# Altium schematic sheet PhaseShifterB.SchDoc
size B; Organization: MASA; SheetNumber: 6; SheetTotal: 6
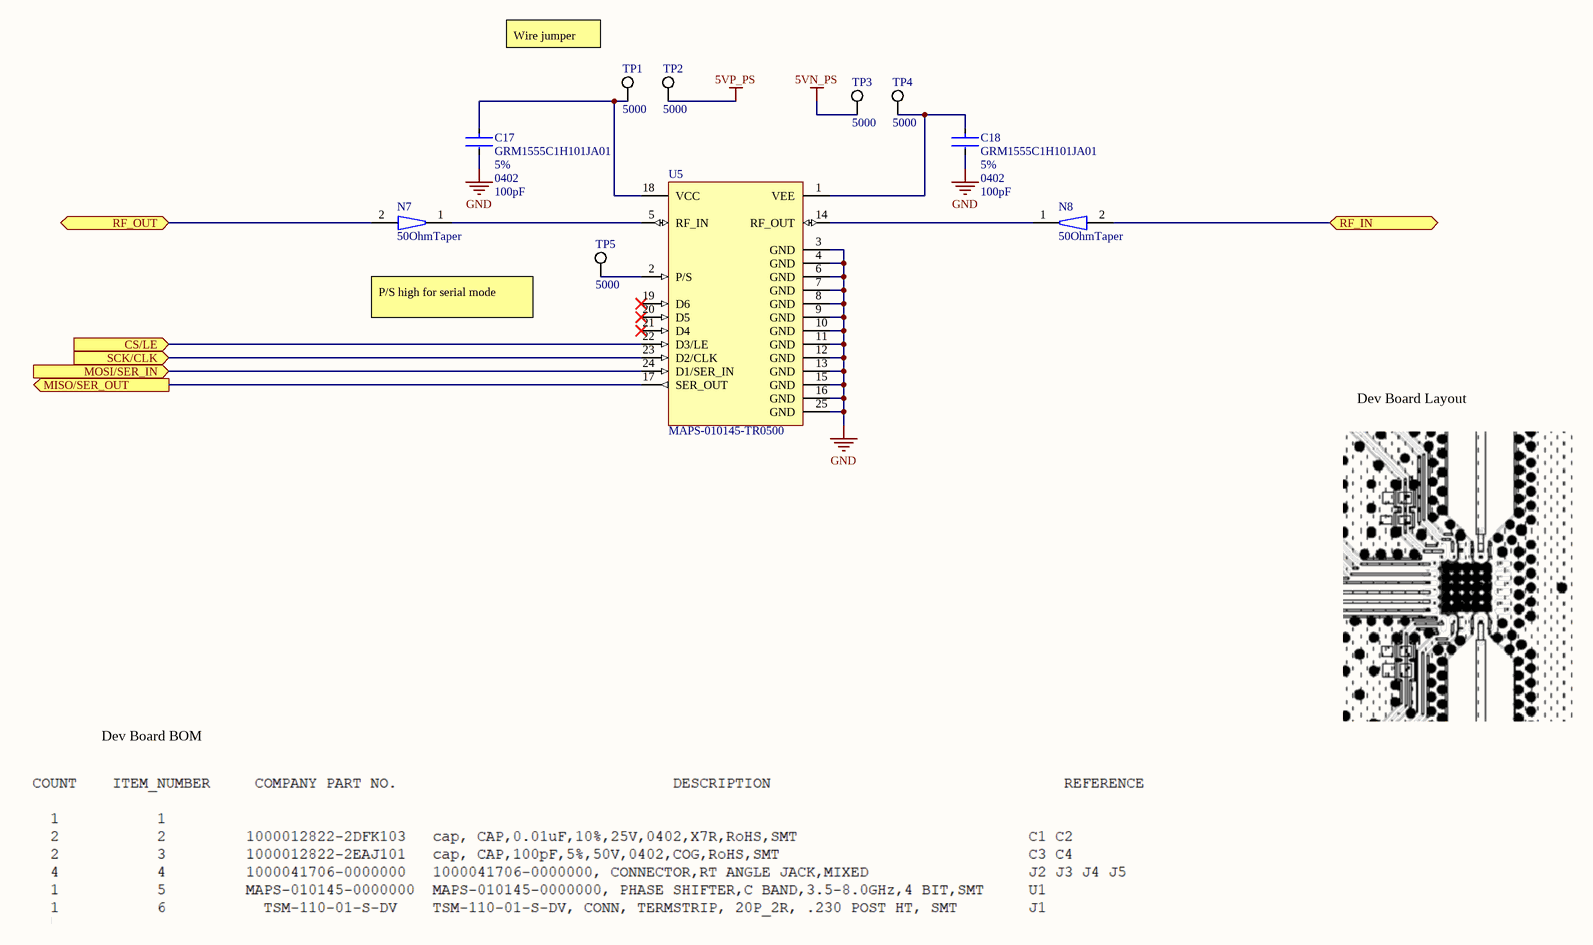
[diagram p0: PhaseShifterB.SchDoc]

## Parts
C17  GRM1555C1H101JA01  value 100pF  Tolerance: 5%  Package: 0402  [Capacitor0402_Murata]
C18  GRM1555C1H101JA01  value 100pF  Tolerance: 5%  Package: 0402  [Capacitor0402_Murata]
N7  50OhmTaper  [50OhmTaper]  (net tie, no BOM)
N8  50OhmTaper  [50OhmTaper]  (net tie, no BOM)
TP1  5000  [FP-5000-MFG]
TP2  5000  [FP-5000-MFG]
TP3  5000  [FP-5000-MFG]
TP4  5000  [FP-5000-MFG]
TP5  5000  [FP-5000-MFG]
U5  MAPS-010145-TR0500  [MAPS-010145-TR0500_QFN50P400X400X100_HS-25N]

## Ports
CS/LE (in), MISO/SER_OUT (out), MOSI/SER_IN (in), RF_IN (bidir), RF_OUT (bidir), SCK/CLK (in)

## Nets
5VN_PS: TP3.1
5VP_PS: TP2.1
GND: C17.2 C18.2 U5.3(GND) U5.4(GND) U5.6(GND) U5.7(GND) U5.8(GND) U5.9(GND) U5.10(GND) U5.11(GND) U5.12(GND) U5.13(GND) U5.15(GND) U5.16(GND) U5.25(GND)
CS/LE: U5.22(D3/LE) ; port CS/LE
MISO/SER_OUT: U5.17(SER_OUT) ; port MISO/SER_OUT
MOSI/SER_IN: U5.24(D1/SER_IN) ; port MOSI/SER_IN
RF_IN: N8.2 ; port RF_IN
RF_OUT: N7.2 ; port RF_OUT
SCK/CLK: U5.23(D2/CLK) ; port SCK/CLK
NetC17_1: C17.1 TP1.1 U5.18(VCC)
NetC18_1: C18.1 TP4.1 U5.1(VEE)
NetN7_1: N7.1 U5.5(RF_IN)
NetN8_1: N8.1 U5.14(RF_OUT)
NetTP5_1: TP5.1 U5.2(P/S)

Not connected (* = marked no-connect by the designer): U5 19(D6)* 20(D5)* 21(D4)*

## Notes on the sheet
- (near TP1) Wire jumper
- P/S high for serial mode
- Dev Board Layout
- Dev Board BOM
- Size: B

## Library data of the parts
C17 C18 = GRM1555C1H101JA01: 100 pF ±5% 50V Ceramic Capacitor C0G, NP0 0402 (1005 Metric); Automotive Grade: Grade 1; Temperature Characteristic: X7R; RoHS: TRUE; Material: Ceramic; Temperature Range High: +125°C; Lead Free: Yes; Category: Cap; ComponentLink2Description: Datasheet; Temperature Range Low: -55°C; Device Class L1: Passive Components; Voltage Rating: 50 V; Automotive: Yes; Device Class L3: Ceramic Capacitors; ComponentLink2URL: https://api.kemet.com/component-edge/download/datasheet/C0603C100J5GACAUTO.pdf; Device Class L2: Capacitors; Supplier 1: Avnet; Supplier Part Number 1: GRM1555C1H101JA01D
N7 N8 = 50OhmTaper: Triangular taper from 50 Ohms to 0402 width
TP1-TP5 = 5000: Red PC Test Point, Miniature Phosphor Bronze Silver Plating Through Hole Mounting Type; Connector Type: Interconnection Device; Contact Finish - Termination: Silver (Ag); Reach SVHC Compliant: Yes; JESD-609 Code: e4; RoHS Compliant: Yes; Pins: 1; Mounting Technology: THT; Supplier 1: Future Electronics; Supplier Part Number 1: 8000564
U5 = MAPS-010145-TR0500: Phase Detectors / Shifters 3.5-6.0GHz 4-Bit Step 22.5 deg.; Supplier 1: Mouser; Supplier Part Number 1: 937-MAPS-010145-T5